# Altium schematic sheet BV100011_DEBUG.SchDoc
size A4
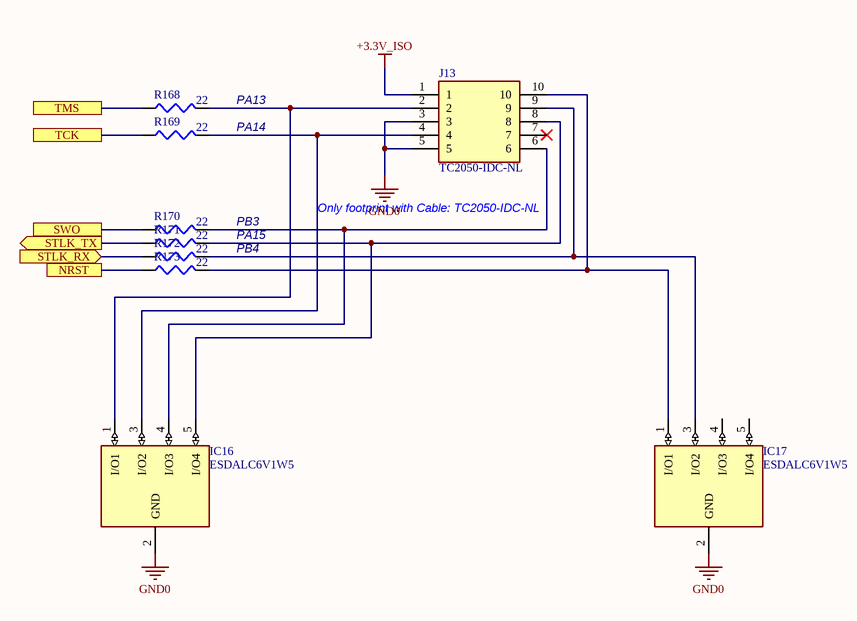
[diagram p0: BV100011_DEBUG.SchDoc]

## Parts
IC16  ESDALC6V1W5  [SOT65P210X110-5N]
IC17  ESDALC6V1W5  [SOT65P210X110-5N]
J13  TC2050-IDC-NL  [CON_TAG-C_TC2050-IDC-NL]
R168  22  [J1-0603]
R169  22  [J1-0603]
R170  22  [J1-0603]
R171  22  [J1-0603]
R172  22  [J1-0603]
R173  22  [J1-0603]

## Ports
NRST, STLK_RX (in), STLK_TX (out), SWO, TCK, TMS

## Nets
+3.3V_ISO: J13.1
GND0: IC16.2(GND) IC17.2(GND) J13.3 J13.5
NRST: R173.1 ; port NRST
STLK_RX: R172.1 ; port STLK_RX
STLK_TX: R171.1 ; port STLK_TX
SWO: R170.1 ; port SWO
TCK: R169.1 ; port TCK
TMS: R168.1 ; port TMS
NetIC16_1: IC16.1(I/O1) J13.2 R168.2
NetIC16_3: IC16.3(I/O2) J13.4 R169.2
NetIC16_4: IC16.4(I/O3) J13.6 R170.2
NetIC16_5: IC16.5(I/O4) J13.8 R171.2
NetIC17_1: IC17.1(I/O1) J13.10 R173.2
NetIC17_3: IC17.3(I/O2) J13.9 R172.2

Not connected (* = marked no-connect by the designer): IC17 4(I/O3) 5(I/O4); J13 7*

## Notes on the sheet
- PA13
- PA14
- PB3
- PA15
- PB4
- Only footprint with Cable: TC2050-IDC-NL

## Library data of the parts
IC16 IC17 = ESDALC6V1W5: Integrated Circuit; Manufacturer_Name: STMicroelectronics; Allied_Number: 70389952; Datasheet Link: http://www.st.com/web/en/resource/technical/document/datasheet/CD00002946.pdf; Height: 1.1mm; Manufacturer_Part_Number: ESDALC6V1W5; Mouser Part Number: 511-ESDALC6V1W5; Mouser Price/Stock: https://www.mouser.com/Search/Refine.aspx?Keyword=511-ESDALC6V1W5; RS Part Number: 0250044P; RS Price/Stock: http://uk.rs-online.com/web/p/products/0250044P; Allied Price/Stock: http://www.alliedelec.com/stmicroelectronics-esdalc6v1w5/70389952/
J13 = TC2050-IDC-NL: Plug-Of-Nailsâ„¢ Adapter Cable; MF: Tag-Connect LLC; MP: TC2050-IDC-NL; Availability: Unavailable; Package: None; Value: *; Price: None; SnapEDA_Link: https://www.snapeda.com/parts/TC2050-IDC-NL/Tag-Connect%20LLC/view-part/134534/?ref=snap
R168-R173 = Res3: Resistor; Published: 8-Jun-2000; LatestRevisionDate: 29-May-2009; LatestRevisionNote: IPC-7351 Footprint Added.; PackageReference: J1-0603; Publisher: Altium Limited; PackageDescription: Chip Resistor; Value: 22